# EAGLE schematic FLIP FLOP 4 LED (EAGLE 7.1.0)
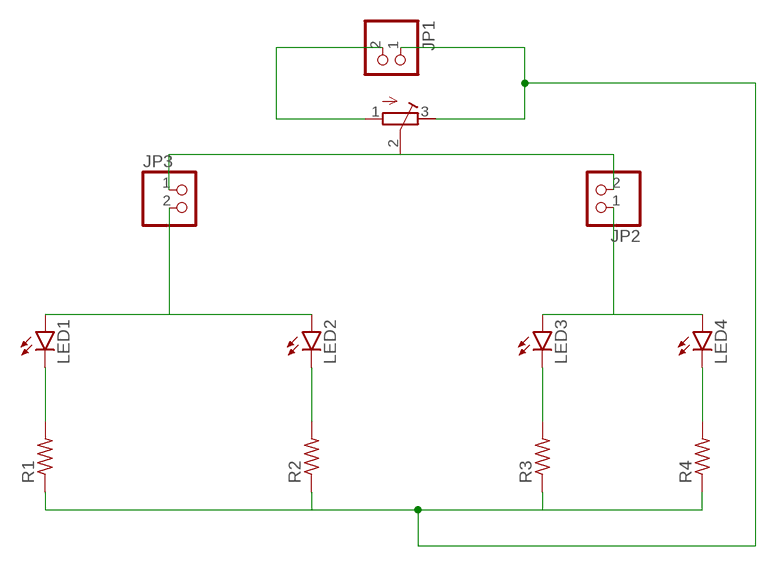
[diagram p0: schematic, sheet 1]

## Parts
JP1  PINHD-1X2  [1X02]
JP2  PINHD-1X2  [1X02]
JP3  PINHD-1X2  [1X02]
LED1  TLLG4400  [LED3MM]
LED2  TLLG4400  [LED3MM]
LED3  TLLR4400  [LED3MM]
LED4  TLLR4400  [LED3MM]
R1  R-US_0204/7  [0204/7]
R2  R-US_0204/7  [0204/7]
R3  R-US_0204/7  [0204/7]
R4  R-US_0204/7  [0204/7]
R5  R-TRIMM3339P  [RTRIM3339P]

## Nets
N$1: JP3.2 LED1.A LED2.A
N$2: LED1.K(C) R1.2
N$3: LED2.K(C) R2.2
N$4: LED4.K(C) R4.2
N$5: LED3.K(C) R3.2
N$6: JP2.1 LED3.A LED4.A
N$7: JP2.2 JP3.1 R5.2(S)
N$8: JP1.2 R5.1(A)
N$9: JP1.1 R1.1 R2.1 R3.1 R4.1 R5.3(E)

## Library data of the parts
JP1-JP3 = pinhead:PINHD-1X2: PIN HEADER
LED1 LED2 = led:TLLG4400: Low Current (2mA) LED 3 mm Tinted Diffused Package color GREEN Source: Data sheet <http://www.farnell.com/datasheets/391098.pdf>; MF: VISHAY SEMICONDUCTOR; OC_FARNELL: 1612435
LED3 LED4 = led:TLLR4400: Low Current (2mA) LED 3 mm Tinted Diffused Package color RED Source: Data sheet <http://www.farnell.com/datasheets/391100.pdf>; MF: VISHAY SEMICONDUCTOR; OC_FARNELL: 1612437
R1-R4 = rcl:R-US_: RESISTOR, American symbol; SPICEPREFIX: R
R5 = rcl:R-TRIMM: Trimm resistor; SPICEMODEL: X; SPICEPREFIXL: POT